# EAGLE schematic CAN_node_rpm_f2v (EAGLE 7.4.0)
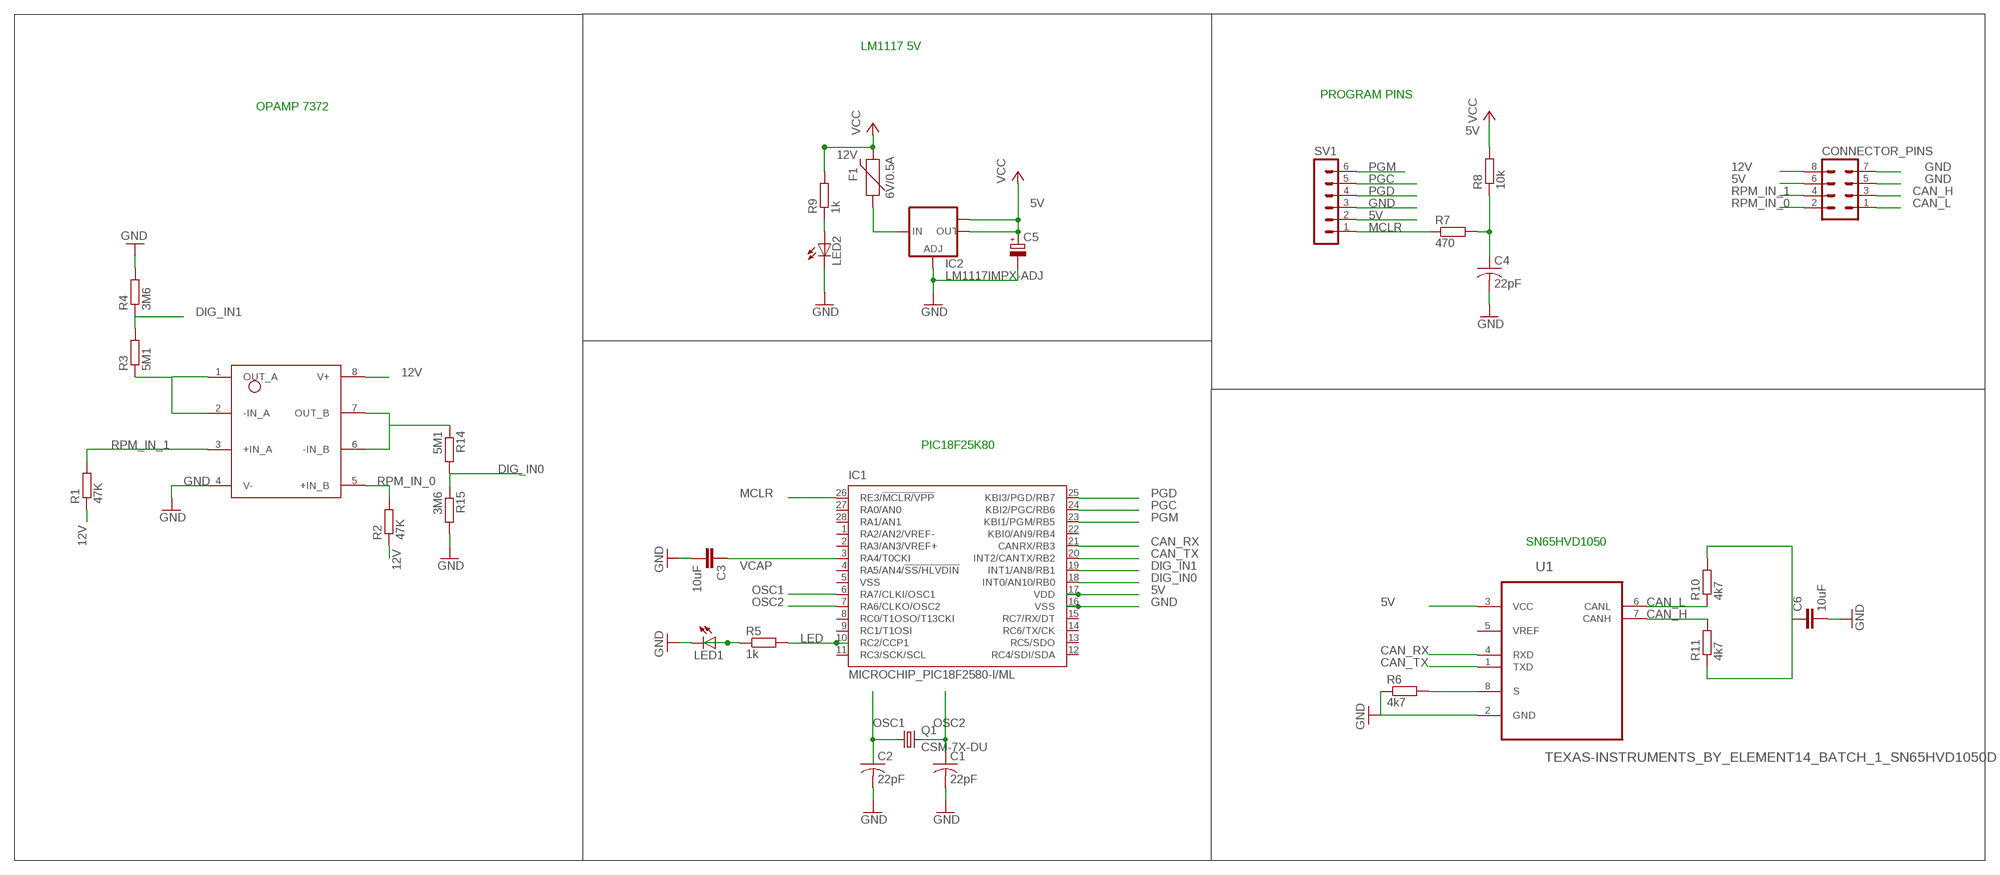
[diagram p0: schematic, sheet 1]

## Parts
C1  22pF  C-USC0805  [C0805]
C2  22pF  C-USC0805  [C0805]
C3  10uF  C-EUC0805  [C0805]
C4  22pF  C-USC0805  [C0805]
C5  CPOL-EUSMCA  [SMC_A]
C6  10uF  C-EUC0805  [C0805]
CONNECTOR_PINS  MA04-2  [MA04-2]
F1  6V/0.5A  PPTC_HALF-AMP  [1206]
IC1  MICROCHIP_PIC18F2580-I/ML  [MICROCHIP_QFN28-ML_6X6MM]
IC2  LM1117IMPX-ADJ  [SOT223]
LED1  LED_LED5MM  [LED_LED5MM]
LED2  LED_LED5MM  [LED_LED5MM]
LM1  7372  [7372]
Q1  CSM-7X-DU  [CSM-7X-DU]
R1  47K  R-EU_R0805  [R0805]
R2  47K  R-EU_R0805  [R0805]
R3  5M1  R-EU_R0805  [R0805]
R4  3M6  R-EU_R0805  [R0805]
R5  1k  R-EU_R0805  [R0805]
R6  4k7  R-EU_R0805  [R0805]
R7  470  R-EU_R0805  [R0805]
R8  10k  R-EU_R0805  [R0805]
R9  1k  R-EU_R0805  [R0805]
R10  4k7  R-EU_R0805  [R0805]
R11  4k7  R-EU_R0805  [R0805]
R14  5M1  R-EU_R0805  [R0805]
R15  3M6  R-EU_R0805  [R0805]
SV1  MA06-1  [MA06-1]
U1  TEXAS-INSTRUMENTS_BY_ELEMENT14_BATCH_1_SN65HVD1050D  [TEXAS-INSTRUMENTS_BY_ELEMENT14_BATCH_1_SOIC127P600X175-8N]

## Nets
5V: C5.+ CONNECTOR_PINS.6 IC1.17(VDD) IC2.2(OUT) IC2.TAB(OUT1) R8.2 SV1.2 U1.3(VCC) ; supply symbol labelled VCC
12V: CONNECTOR_PINS.8 F1.2 LM1.8(V+) R1.1 R2.1 R9.2 ; supply symbol labelled VCC
CAN_H: CONNECTOR_PINS.3 R11.2 U1.7(CANH)
CAN_L: CONNECTOR_PINS.1 R10.1 U1.6(CANL)
CAN_RX: IC1.21(CANRX/RB3) U1.4(RXD)
CAN_TX: IC1.20(INT2/CANTX/RB2) U1.1(TXD)
DIG_IN0: IC1.18(INT0/AN10/RB0) R14.2 R15.1
DIG_IN1: IC1.19(INT1/AN8/RB1) R3.2 R4.1
GND: C1.2 C2.2 C3.2 C4.2 C5.- C6.2 CONNECTOR_PINS.5 CONNECTOR_PINS.7 IC1.16(VSS) IC2.1(ADJ) LED1.K(C) LED2.K(C) LM1.4(V-) R4.2 R6.1 R15.2 SV1.3 U1.2(GND)
LED: IC1.10(RC2/CCP1) R5.2
MCLR: IC1.26(RE3/!MCLR/VPP) R7.1 SV1.1
N$1: LED1.A R5.1
N$2: R6.2 U1.8(S)
N$3: C4.1 R7.2 R8.1
N$4: F1.1 IC2.3(IN)
N$5: LED2.A R9.1
N$7: C6.1 R10.2 R11.1
N$8: LM1.1(OUT_A) LM1.2(-IN_A) R3.1
N$10: LM1.6(-IN_B) LM1.7(OUT_B) R14.1
OSC1: C2.1 IC1.6(RA7/CLKI/OSC1) Q1.1
OSC2: C1.1 IC1.7(RA6/CLKO/OSC2) Q1.2
PGC: IC1.24(KBI2/PGC/RB6) SV1.5
PGD: IC1.25(KBI3/PGD/RB7) SV1.4
PGM: IC1.23(KBI1/PGM/RB5) SV1.6
RPM_IN_0: CONNECTOR_PINS.2 LM1.5(+IN_B) R2.2
RPM_IN_1: CONNECTOR_PINS.4 LM1.3(+IN_A) R1.2
VCAP: C3.1 IC1.3(RA4/T0CKI)
Unconnected: IC1.1(RA2/AN2/VREF-) IC1.2(RA3/AN3/VREF+) IC1.4(RA5/AN4/!SS/HLVDIN) IC1.8(RC0/T1OSO/T13CKI) IC1.9(RC1/T1OSI) IC1.11(RC3/SCK/SCL) IC1.12(RC4/SDI/SDA) IC1.13(RC5/SDO) IC1.14(RC6/TX/CK) IC1.15(RC7/RX/DT) IC1.22(KBI0/AN9/RB4) IC1.27(RA0/AN0) IC1.28(RA1/AN1) U1.5(VREF)

## Notes on the sheet
- LM1117 5V
- PROGRAM PINS
- OPAMP 7372
- PIC18F25K80
- SN65HVD1050

## Power pins joined to a net without a drawn wire
VSS: IC1.5(VSS)

## Library data of the parts
C1 C2 C4 = resistor:C-US: CAPACITOR, American symbol
C3 C6 = resistor:C-EU: CAPACITOR, European symbol
C5 = rcl:CPOL-EU: POLARIZED CAPACITOR, European symbol
CONNECTOR_PINS = con-lstb:MA04-2: PIN HEADER; OC_FARNELL: unknown; OC_NEWARK: unknown
F1 = sparkfun_fuses:PPTC: Resettable Fuse PPTC Resettable Fuse. Really a sort of resistor with a polymeric positive temperature coefficient whose resistance increases dramatically with an increase in temperature. When heated by the power passing through the resistance rises causing the current to be limited, protecting the circuit. This is achieved by the transition of the polymer from a crystalline to an amorphous state where the conductive carbon separates breaking the conductive pathways found in the cool crystalline structure. When a PPTC cools back down it resumes conducting letting the circuit turn back on. SparkFun Products: SparkFun RedBoard - Programmed with Arduino <https://www.sparkfun.com/products/12757> Pro Micro - 5V/16MHz <https://www.sparkfun.com/products/12640> Arduino Pro 328 - 5V/16MHz <https://www.sparkfun.com/products/10915> MP3 Trigger <https://www.sparkfun.com/products/13720>; PROD_ID: RES-08585
IC1 = IITBRacing_CAN_node_Evo5:MICROCHIP_PIC18F2*80: 28-Pin Enhanced Flash Microcontrollers with ECAN(TM) Technology 10-Bit A/D and nanoWatt Technology Source: http://www.microchip.com .. 39637a.pdf; MF: MICROCHIP; MPN: PIC18F2580-I/ML; OC_FARNELL: 1556180; OC_NEWARK: 71J7242
IC2 = lm1117:LM1117IMPX-ADJ
LED1 LED2 = IITBRacing_CAN_node_Evo5:LED_LED: LED OSRAM: - CHIPLED LG R971, LG N971, LY N971, LG Q971, LY Q971, LO R971, LY R971 LH N974, LH R974 LS Q976, LO Q976, LY Q976 LO Q996 - Hyper CHIPLED LW Q18S LB Q993, LB Q99A, LB R99A - SideLED LS A670, LO A670, LY A670, LG A670, LP A670 LB A673, LV A673, LT A673, LW A673 LH A674 LY A675 LS A676, LA A676, LO A676, LY A676, LW A676 LS A679, LY A679, LG A679 - Hyper Micro SIDELED® LS Y876, LA Y876, LO Y876, LY Y876 LT Y87S - SmartLED LW L88C, LW L88S LB L89C, LB L89S, LG L890 LS L89K, LO L89K, LY L89K LS L896, LA L896, LO L896, LY L896 - TOPLED LS T670, LO T670, LY T670, LG T670, LP T670 LSG T670, LSP T670, LSY T670, LOP T670, LYG T670 LG T671, LOG T671, LSG T671 LB T673, LV T673, LT T673, LW T673 LH T674 LS T676, LA T676, LO T676, LY T676, LB T676, LH T676, LSB T676, LW T676 LB T67C, LV T67C, LT T67C, LS T67K, LO T67K, LY T67K, LW E67C LS E67B, LA E67B, LO E67B, LY E67B, LB E67C, LV E67C, LT E67C LW T67C LS T679, LY T679, LG T679 LS T770, LO T770, LY T770, LG T770, LP T770 LB T773, LV T773, LT T773, LW T773 LH T774 LS E675, LA E675, LY E675, LS T675 LS T776, LA T776, LO T776, LY T776, LB T776 LHGB T686 LT T68C, LB T68C - Hyper Mini TOPLED® LB M676 - Mini TOPLED Santana® LG M470 LS M47K, LO M47K, LY M47K Source: http://www.osram.convergy.de LUXEON: - LUMILED® LXK2-PW12-R00, LXK2-PW12-S00, LXK2-PW14-U00, LXK2-PW14-V00 LXK2-PM12-R00, LXK2-PM12-S00, LXK2-PM14-U00 LXK2-PE12-Q00, LXK2-PE12-R00, LXK2-PE12-S00, LXK2-PE14-T00, LXK2-PE14-U00 LXK2-PB12-K00, LXK2-PB12-L00, LXK2-PB12-M00, LXK2-PB14-N00, LXK2-PB14-P00, LXK2-PB14-Q00 LXK2-PR12-L00, LXK2-PR12-M00, LXK2-PR14-Q00, LXK2-PR14-R00 LXK2-PD12-Q00, LXK2-PD12-R00, LXK2-PD12-S00 LXK2-PH12-R00, LXK2-PH12-S00 LXK2-PL12-P00, LXK2-PL12-Q00, LXK2-PL12-R00 Source: www.luxeon.com KINGBRIGHT: KA-3528ASYC Source: www.kingbright.com
LM1 = 7372:7372
Q1 = crystal:CSM-7X-DU: SMD CRYSTAL Source: www.ecsxtal.com .. Crystal 3.6864MHz CSM_7X_DU.PDF; OC_FARNELL: unknown; OC_NEWARK: unknown
R1-R11 R14 R15 = resistor:R-EU_: RESISTOR, European symbol
SV1 = con-lstb:MA06-1: PIN HEADER; OC_FARNELL: unknown; OC_NEWARK: unknown
U1 = IITBRacing_CAN_node_Evo5:TEXAS-INSTRUMENTS_BY_ELEMENT14_BATCH_1_SN65HVD1050D: EMC OPTIMIZED CAN TRANSCEIVER; MPN: SN65HVD1050D; OC_FARNELL: 1220984; OC_NEWARK: 70K4439; PACKAGE: SOIC-8; SUPPLIER: Texas Instruments